# EAGLE design HelvePicV1_1SMDbb (EAGLE 7.3.0)
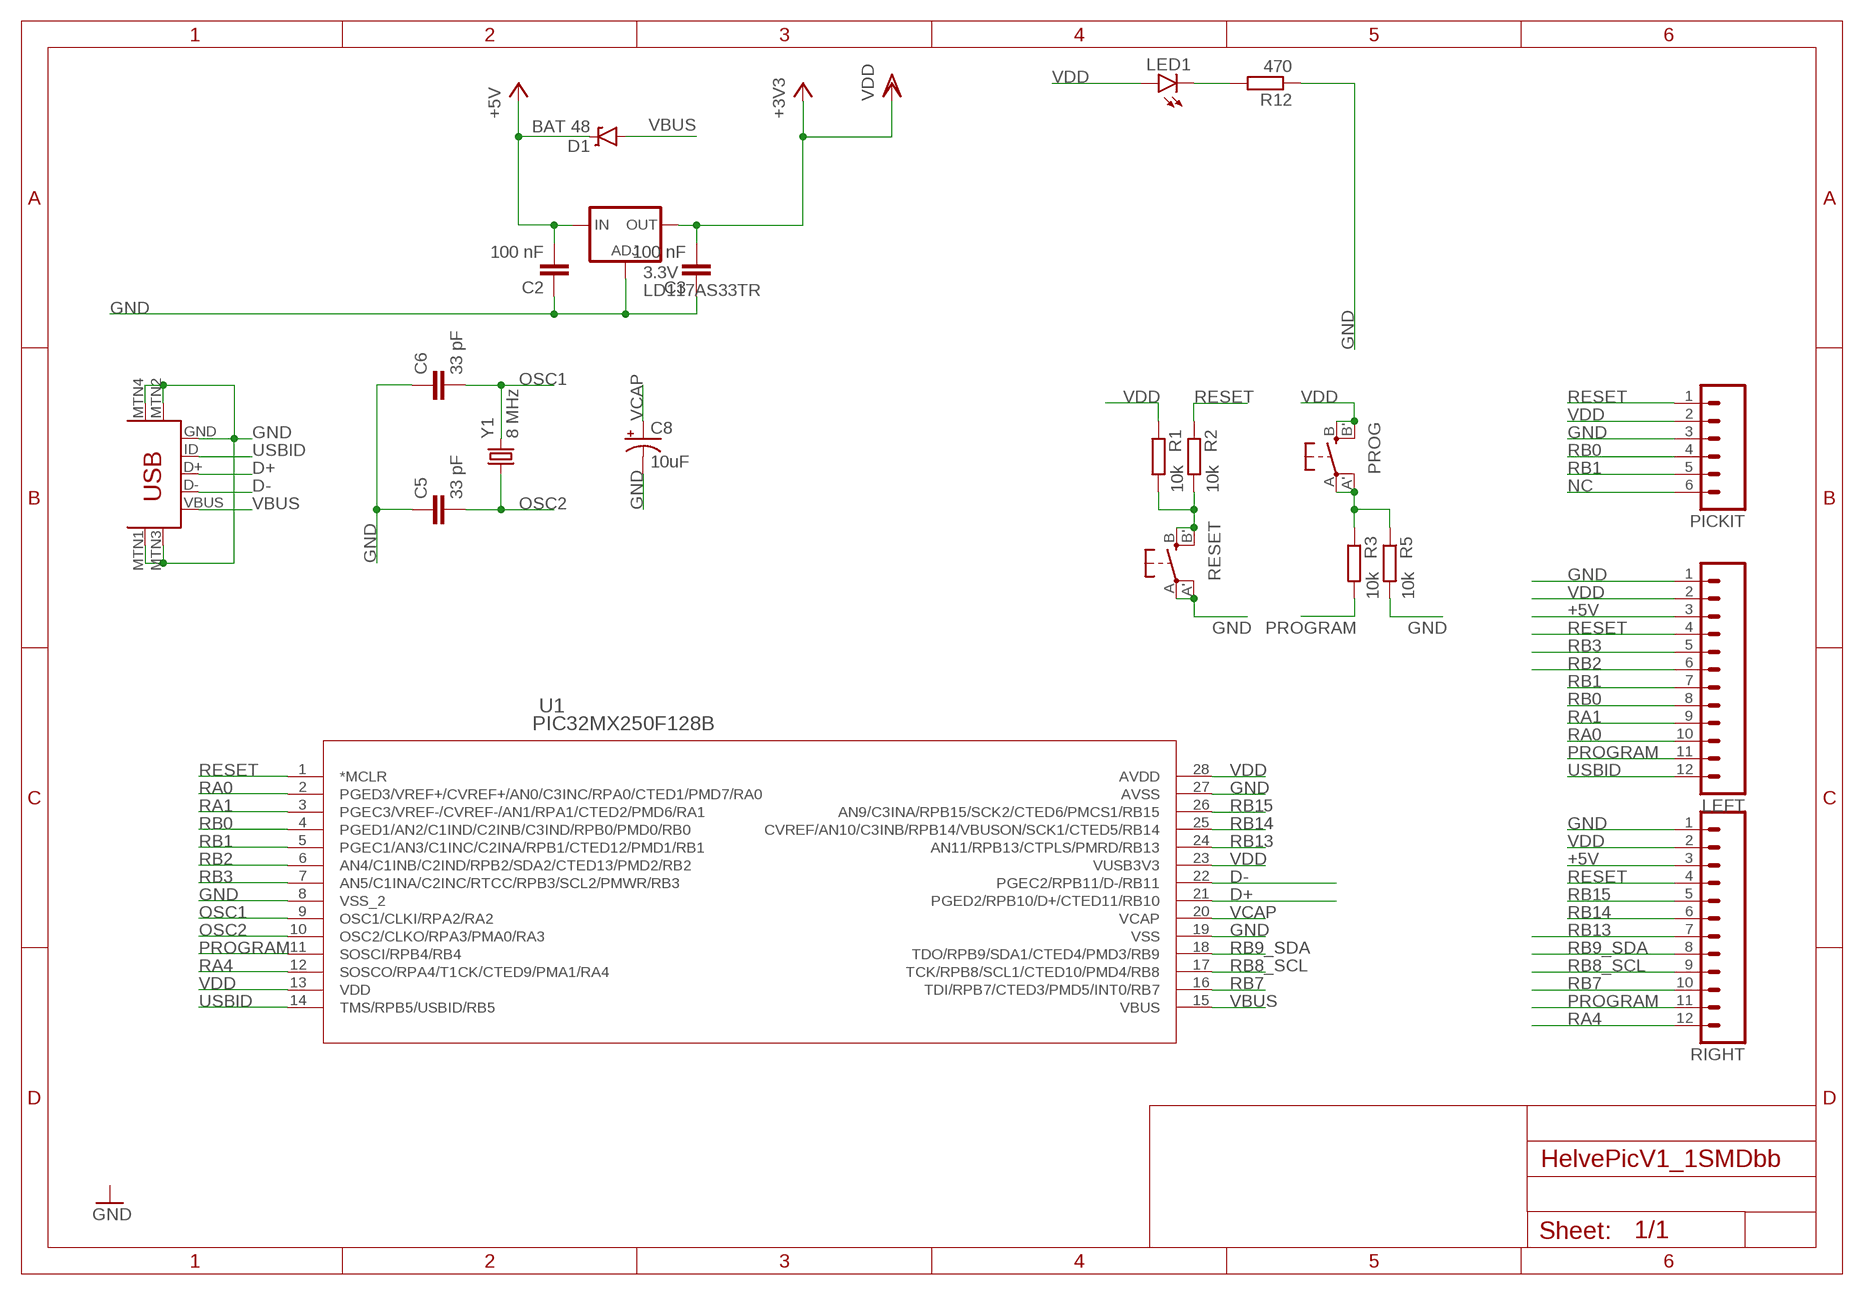
[diagram p0: schematic, sheet 1]

## Parts
3.3V  LD117AS33TR  [SOT223]
C2  100 nF  CAP0805  [0805]
C3  100 nF  CAP0805  [0805]
C5  33 pF  CAP0805  [0805]
C6  33 pF  CAP0805  [0805]
C8  10uF  10UF-16V-10%(TANT)  [EIA3216]
D1  BAT 48  DIODE-ZENERSMB  [SMB-DIODE]
LED1  LED1206  [LED-1206]
LEFT  M12PTH  [1X12]
PICKIT  M06LOCK  [1X06_LOCK]
PROG  SPST_TACT-EVQQ2  [EVQ-Q2]
R1  10k  R-EU_M0805  [M0805]
R2  10k  R-EU_M0805  [M0805]
R3  10k  R-EU_M0805  [M0805]
R5  10k  R-EU_M0805  [M0805]
R12  470  R-EU_M0805  [M0805]
RESET  SPST_TACT-EVQQ2  [EVQ-Q2]
RIGHT  M12PTH  [1X12]
U1  PIC32MX250F128B  PIC32MX250F128B-I_SO  [SOIC28-W_MC]
U$2  USB-MINIB-5PIN  [USB-MINIB]
Y1  8 MHz  CRYSTALSMD  [HC49UP]

## Nets
+5V: 3.3V.3(IN) C2.2 D1.C LEFT.3 RIGHT.3
D+: U1.21(PGED2/RPB10/D+/CTED11/RB10) U$2.D+
D-: U1.22(PGEC2/RPB11/D-/RB11) U$2.D-
GND: 3.3V.1(ADJ) C2.1 C3.1 C5.1 C6.1 C8.C(-) LEFT.1 PICKIT.3 R5.2 R12.1 RESET.A'(P1) RESET.A(P) RIGHT.1 U1.8(VSS_2) U1.19(VSS) U1.27(AVSS) U$2.GND U$2.MTN1(MTN2) U$2.MTN2(MTN3) U$2.MTN3(MTN1) U$2.MTN4
N$2: LED1.C R12.2
N$9: PROG.A'(P1) PROG.A(P) R3.1 R5.1
N$10: R1.2 R2.2 RESET.B'(S1) RESET.B(S)
NC: PICKIT.6
OSC1: C6.2 U1.9(OSC1/CLKI/RPA2/RA2) Y1.2
OSC2: C5.2 U1.10(OSC2/CLKO/RPA3/PMA0/RA3) Y1.1
PROGRAM: LEFT.11 R3.2 RIGHT.11 U1.11(SOSCI/RPB4/RB4)
RA0: LEFT.10 U1.2(PGED3/VREF+/CVREF+/AN0/C3INC/RPA0/CTED1/PMD7/RA0)
RA1: LEFT.9 U1.3(PGEC3/VREF-/CVREF-/AN1/RPA1/CTED2/PMD6/RA1)
RA4: RIGHT.12 U1.12(SOSCO/RPA4/T1CK/CTED9/PMA1/RA4)
RB0: LEFT.8 PICKIT.4 U1.4(PGED1/AN2/C1IND/C2INB/C3IND/RPB0/PMD0/RB0)
RB1: LEFT.7 PICKIT.5 U1.5(PGEC1/AN3/C1INC/C2INA/RPB1/CTED12/PMD1/RB1)
RB2: LEFT.6 U1.6(AN4/C1INB/C2IND/RPB2/SDA2/CTED13/PMD2/RB2)
RB3: LEFT.5 U1.7(AN5/C1INA/C2INC/RTCC/RPB3/SCL2/PMWR/RB3)
RB7: RIGHT.10 U1.16(TDI/RPB7/CTED3/PMD5/INT0/RB7)
RB8_SCL: RIGHT.9 U1.17(TCK/RPB8/SCL1/CTED10/PMD4/RB8)
RB9_SDA: RIGHT.8 U1.18(TDO/RPB9/SDA1/CTED4/PMD3/RB9)
RB13: RIGHT.7 U1.24(AN11/RPB13/CTPLS/PMRD/RB13)
RB14: RIGHT.6 U1.25(CVREF/AN10/C3INB/RPB14/VBUSON/SCK1/CTED5/RB14)
RB15: RIGHT.5 U1.26(AN9/C3INA/RPB15/SCK2/CTED6/PMCS1/RB15)
RESET: LEFT.4 PICKIT.1 R2.1 RIGHT.4 U1.1(*MCLR)
USBID: LEFT.12 U1.14(TMS/RPB5/USBID/RB5) U$2.ID
VBUS: D1.A U1.15(VBUS) U$2.VBUS
VCAP: C8.A(+) U1.20(VCAP)
VDD: 3.3V.4(OUT) C3.2 LED1.A LEFT.2 PICKIT.2 PROG.B'(S1) PROG.B(S) R1.1 RIGHT.2 U1.13(VDD) U1.23(VUSB3V3) U1.28(AVDD) ; supply symbol labelled +3V3

## Library data of the parts
3.3V = v-reg:LD117A?*: Low drop fixed and adjustable positive voltage regulators 1 A Source: http://www.st.com/stonline/products/literature/ds/7194/ld1117axx.pdf
C2 C3 C5 C6 = SparkFun-Capacitors:CAP: Capacitor Standard 0603 ceramic capacitor, and 0.1" leaded capacitor.
C8 = SparkFun-Capacitors:10UF-16V-10%(TANT): CAP-00811 1206/EIA-3216 Tantalum capacitor; PROD_ID: CAP-00811
D1 = SparkFun-DiscreteSemi:DIODE-ZENER: Zener Diode Production Part - 8199 3.4V Zener Voltage
LED1 = SparkFun-LED:LED: LEDs Standard schematic elements and footprints for 5mm, 3mm, 1206, and 0603 sized LEDs. 5mm - Spark Fun Electronics SKU : COM-00529 (and others)
LEFT RIGHT = SparkFun-Connectors:M12: Header 12 Standard 12-pin 0.1" header. Use with straight break away headers (SKU : PRT-00116), right angle break away headers (PRT-00553), swiss pins (PRT-00743), machine pins (PRT-00117), and female headers (PRT-00115).
PICKIT = SparkFun-Connectors:M06: Header 6 Standard 6-pin 0.1" header. Use with straight break away headers (SKU : PRT-00116), right angle break away headers (PRT-00553), swiss pins (PRT-00743), machine pins (PRT-00117), and female headers (PRT-00115). Molex polarized connector foot print use with SKU : PRT-08094 with associated crimp pins and housings. NOTES ON THE VARIANTS LOCK and LOCK_LONGPADS... This footprint was designed to help hold the alignment of a through-hole component (i.e. 6-pin header) while soldering it into place. You may notice that each hole has been shifted either up or down by 0.005 of an inch from it's more standard position (which is a perfectly straight line). This slight alteration caused the pins (the squares in the middle) to touch the edges of the holes. Because they are alternating, it causes a "brace" to hold the component in place. 0.005 has proven to be the perfect amount of "off-center" position when using our standard breakaway headers. Although looks a little odd when you look at the bare footprint, once you have a header in there, the alteration is very hard to notice. Also,if you push a header all the way into place, it is covered up entirely on the bottom side. This idea of altering the position of holes to aid alignment will be further integrated into the Sparkfun Library for other footprints. It can help hold any component with 3 or more connection pins.
PROG RESET = adafruit:SPST_TACT: SMT 6mm switch, EVQQ2 series http://www.ladyada.net/library/eagle
R1-R3 R5 R12 = resistor:R-EU_: RESISTOR, European symbol
U1 = myPIC:PIC32MX250F128B-I_SO
U$2 = SparkFun-Connectors:USB-MINIB: Mini-USB "B" connector with 5th pin broken out. Created new symbol breaking out 5th "ID" pin in mini/micro USB connector spec. See: http://en.wikipedia.org/wiki/Mini_usb#Cables. Uses same footprint as 4-pin symbol. Also added pins to connect to mounting / shield pads if required (probably not generally needed as signals aren't shielded once they leave the connector).
Y1 = SparkFun-FreqCtrl:CRYSTAL: Various standard crystals. Proven footprints. Spark Fun Electronics SKU : COM-00534

## Board
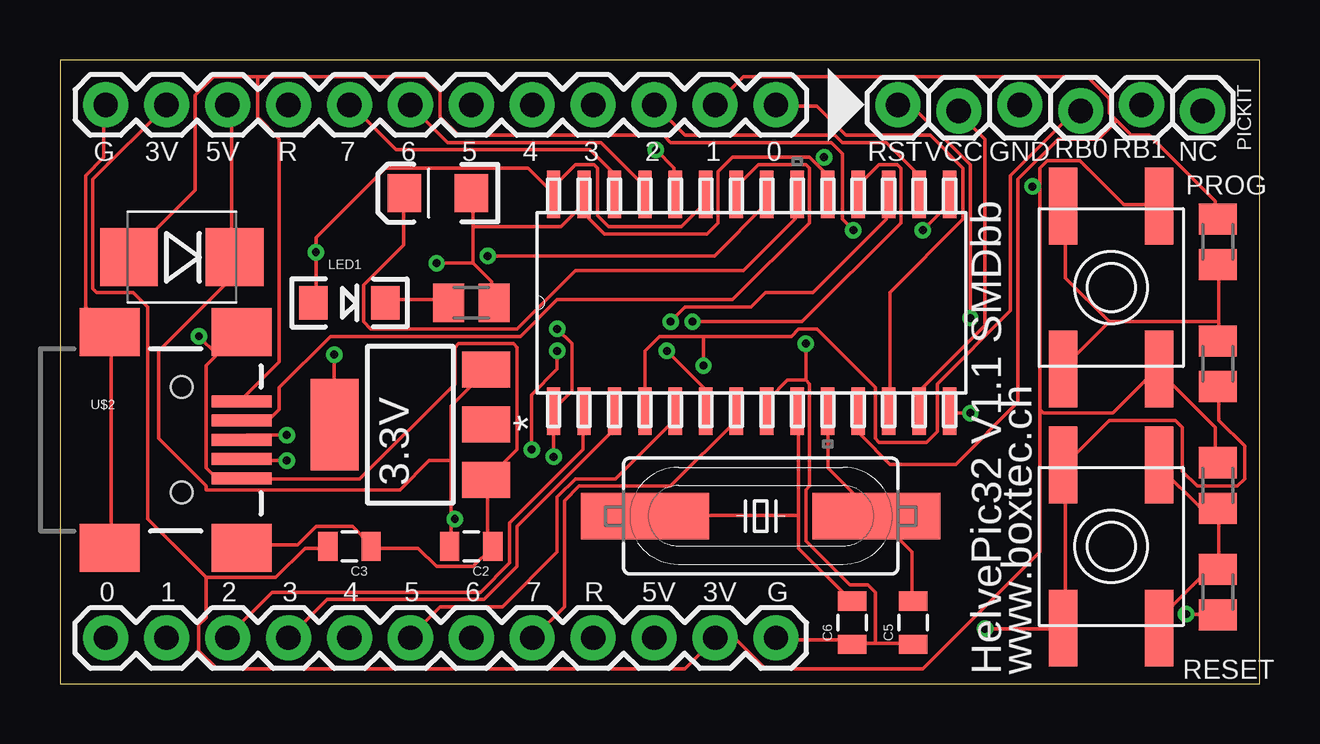
[diagram p1: board, top side]
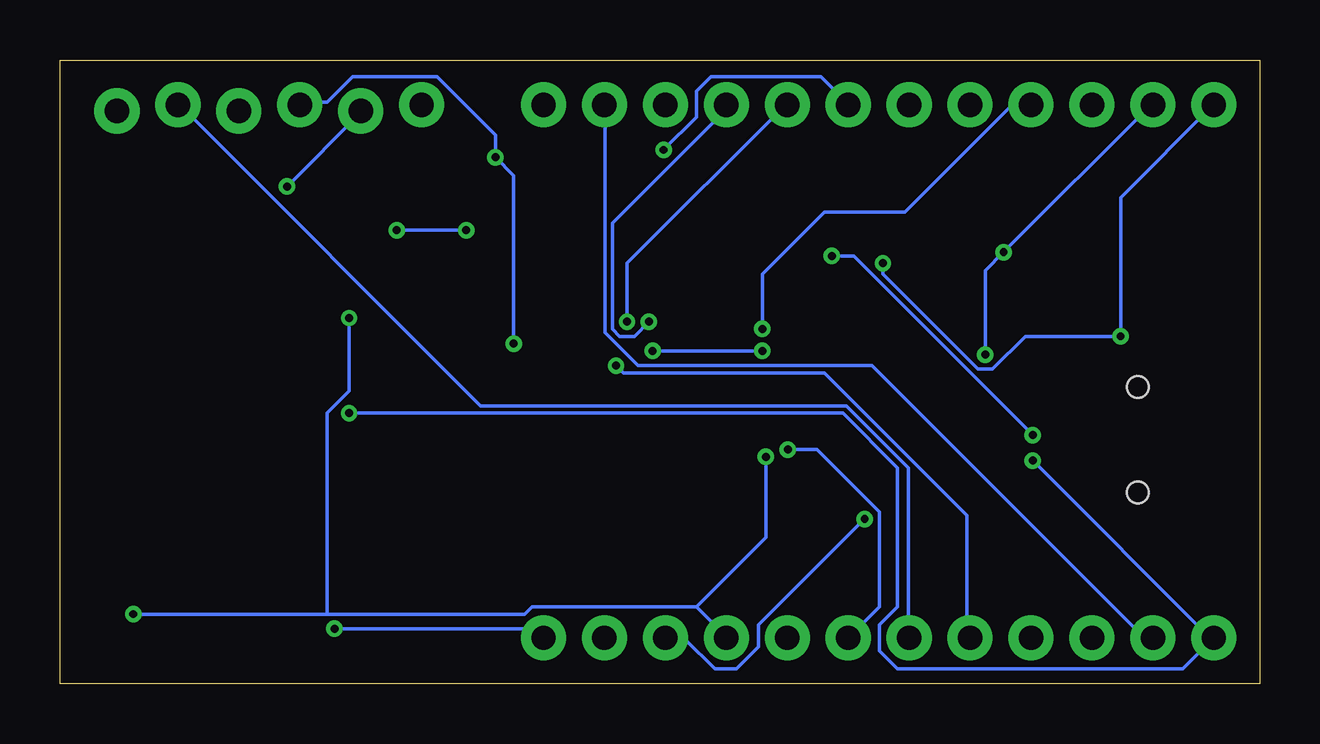
[diagram p2: board, bottom side, seen from below]

Size 50 x 26 mm. Coordinates in mm from the lower left corner, seen from the top.
Outline: 0,0 50,0 50,26 0,26 0,0
Copper layers (1*16): Top 0.0356mm / dielectric 1.5011mm / Bottom 0.0356mm
Design rules "oshpark-2layer": minimum track width 6mil, minimum drill 13mil, track to track 6mil, track to pad 6mil, pad to pad 6mil, via to via 6mil, smd to smd 6mil, copper to edge 15mil, drill to drill 6mil, minimum pad ring 7mil, minimum via ring 7mil, stop-mask expansion 4mil, vias tented up to drill 0mil, thermal gap 10mil

### Footprints (pad centres in the part's own frame; a part is rotated, then mirrored left to right if it is on the bottom)
SOT223 = smd 1.5 x 2: 1 -2.3,-3.15; 2 0,-3.15; 3 2.3,-3.15 | smd 3.8 x 2: 4 0,3.15
0805 = smd 0.8 x 1.2: 1 -0.9,0; 2 0.9,0
EIA3216 = smd 1.4 x 1.6: A 1.4,0; C -1.4,0
SMB-DIODE = smd 2.4 x 2.4: A 2.2,0; C -2.2,0
LED-1206 = smd 1.2 x 1.4: A -1.5,0; C 1.5,0
1X12 = drill 1.016 pad 1.88: 1 0,0; 2 2.54,0; 3 5.08,0; 4 7.62,0; 5 10.16,0; 6 12.7,0; 7 15.24,0; 8 17.78,0; 9 20.32,0; 10 22.86,0; 11 25.4,0; 12 27.94,0
1X06_LOCK = drill 1.016 pad 1.88: 1 0,0; 2 2.54,-0.254; 3 5.08,0; 4 7.62,-0.254; 5 10.16,0; 6 12.7,-0.254
EVQ-Q2 = smd 3.2 x 1.2: A -3.4,-2; A' 3.4,-2; B -3.4,2; B' 3.4,2
M0805 = smd 1.3 x 1.6: 1 -0.95,0; 2 0.95,0
SOIC28-W_MC = smd 1.981 x 0.559: 1 -4.521,8.255; 2 -4.521,6.985; 3 -4.521,5.715; 4 -4.521,4.445; 5 -4.521,3.175; 6 -4.521,1.905; 7 -4.521,0.635; 8 -4.521,-0.635; 9 -4.521,-1.905; 10 -4.521,-3.175; 11 -4.521,-4.445; 12 -4.521,-5.715; 13 -4.521,-6.985; 14 -4.521,-8.255; 15 4.521,-8.255; 16 4.521,-6.985; 17 4.521,-5.715; 18 4.521,-4.445; 19 4.521,-3.175; 20 4.521,-1.905; 21 4.521,-0.635; 22 4.521,0.635; 23 4.521,1.905; 24 4.521,3.175; 25 4.521,4.445; 26 4.521,5.715; 27 4.521,6.985; 28 4.521,8.255
USB-MINIB = smd 2.5 x 0.5: D+ 2.5,0; D- 2.5,0.8; GND 2.5,-1.6; ID 2.5,-0.8; VBUS 2.5,1.6 | smd 2.5 x 2: MTN1 -3,4.5; MTN2 2.5,4.5; MTN3 -3,-4.5; MTN4 2.5,-4.5 | hole 0.9: 0,2.2; 0,-2.2
HC49UP = smd 5.334 x 1.93: 1 -4.826,0; 2 4.826,0

### Placement (x,y rotation side)
3.3V  14.61,10.79 90 top
C2  17.14,5.71 180 top
C3  12.06,5.71 180 top
C5  35.56,2.54 90 top
C6  33.02,2.54 90 top
C8  15.75,20.45 180 top
D1  5.08,17.78 180 top
LED1  12.06,15.88 0 top
LEFT  29.84,1.91 180 top
PICKIT  34.92,24.13 0 top
PROG  43.81,16.51 270 top
R1  48.26,8.26 270 top
R2  48.26,3.81 90 top
R3  48.26,18.41 90 top
R5  48.26,13.34 270 top
R12  17.14,15.88 180 top
RESET  43.81,5.71 270 top
RIGHT  1.91,24.13 0 top
U1  28.83,15.88 90 top
U$2  5.08,10.16 0 top
Y1  29.21,6.99 180 top

### Tracks (layer width: path | path; a pad name or v marks a point on that pad's centre or on a via)
+5V  (via drill 0.33)
  Top 0.152: RIGHT.3 7.01,24.08 7.16,23.93 7.16,17.83 D1.C 7.16,17.68 7.16,16.92 4.12,13.87 4.12,10.21 6.1,8.23 6.1,8.08 14.17,8.08 15.39,9.3 16.31,9.3 | 16.31,9.3 16.31,11.58 17.68,12.95 3.3V.3 | 16.31,9.3 16.31,6.86 | 16.31,6.86 16.31,5.79 C2.2 | 16.31,6.86 v16.46,6.86
  Bottom 0.152: v16.46,6.86 20.88,2.44 20.88,1.52 21.79,0.61 22.71,0.61 23.93,1.83 24.69,1.83 LEFT.3
D+  (via drill 0.33)
  Top 0.152: v17.83,17.83 27.28,17.83 29.41,19.96 29.41,20.27 U1.21 | v9.45,10.36 7.77,10.36 7.62,10.21 U$2.D+
  Bottom 0.152: v17.83,17.83 16.92,17.83 v9.45,10.36
D-
  Top 0.152: U1.22 28.19,20.73 29.11,21.64 31.09,21.64 31.24,21.49 31.24,19.2 28.04,16 20.73,16 19.2,14.48 11.28,14.48 9.14,12.34 9.14,11.43 8.69,10.97 7.62,10.97 U$2.D-
GND  (via drill 0.33)
  Top 0.152: 6.55,13.72 7.47,14.63 U$2.MTN2 6.55,13.72 | 6.55,13.72 6.1,13.26 6.1,8.99 6.4,8.69 7.47,8.69 U$2.GND 7.62,8.53 12.5,8.53 16.46,12.5 16.46,14.02 16.61,14.17 18.9,14.17 19.05,14.02 19.05,9.75 17.83,8.53 3.3V.1 17.83,8.38 17.83,5.94 17.98,5.79 C2.1 17.98,5.64 17.22,4.88 15.7,4.88 14.94,5.64 13.11,5.64 C3.1 12.95,5.79 12.19,6.55 10.67,6.55 9.91,5.79 7.62,5.79 U$2.MTN4 | U$2.MTN3 2.13,5.79 2.13,14.63 U$2.MTN1 1.98,14.78 1.07,15.7 1.07,21.18 1.83,21.95 1.83,24.08 RIGHT.1 | v5.79,14.48 6.55,13.72 | R5.2 48.31,12.34 48.31,10.97 49.38,9.91 49.38,8.53 49.07,8.23 47.4,8.23 46.79,8.84 46.79,10.67 46.48,10.97 43.74,10.97 41.91,9.14 RESET.A 41.91,8.99 41.91,2.44 RESET.A' 41.76,2.29 v38.56,2.29 | 33.98,1.68 35.51,1.68 C5.1 | 33.98,1.68 33.07,1.68 C6.1 32.92,1.68 32.77,1.83 29.87,1.83 LEFT.1 | 31.09,12.65 30.33,12.65 29.57,11.89 29.57,11.43 U1.8 | 31.09,12.65 31.24,12.5 31.24,8.23 31.09,8.08 31.09,5.94 32.92,4.12 33.68,4.12 33.98,3.81 33.98,1.68 | 17.22,17.53 17.98,16.76 17.98,16 R12.1 | 17.22,19.05 17.22,20.42 C8.C | 17.22,19.05 17.22,17.53 | 21.64,19.81 20.88,19.05 17.22,19.05 | 21.64,19.81 21.79,19.96 21.79,20.27 U1.27 21.64,19.81 | U1.19 32,21.18 31.55,21.64 | 31.55,21.64 31.24,21.95 28.04,21.95 27.43,21.34 27.43,19.2 26.98,18.75 22.71,18.75 21.64,19.81 | 31.55,21.64 v31.85,21.95 | v31.09,14.17 31.09,12.65 | 17.22,17.53 v15.7,17.53
  Bottom 0.152: RIGHT.1 1.98,24.08 5.79,20.27 v5.79,14.48 9.75,14.48 11.12,13.11 11.73,13.11 15.7,17.07 v15.7,17.53 | PICKIT.3 39.93,24.23 38.86,24.23 37.8,25.3 34.29,25.3 31.85,22.86 v31.85,21.95 31.09,21.18 v31.09,14.17 | v38.56,2.29 30.18,2.29 29.87,1.98 LEFT.1
N$2
  Top 0.152: LED1.C 13.72,16 16.15,16 R12.2
N$9
  Top 0.152: 48.31,15.09 48.31,17.37 R3.1 | 48.31,15.09 48.31,14.33 R5.1 | 43.74,15.09 48.31,15.09 | 43.74,15.09 41.91,13.26 PROG.A' | 43.74,15.09 41.91,16.92 41.91,19.81 PROG.A
N$10
  Top 0.152: RESET.B 45.87,8.99 47.55,7.32 48.16,7.32 R1.2 48.31,7.16 48.31,4.88 R2.2 48.16,4.72 47.85,4.72 45.87,2.74 45.87,2.44 RESET.B'
OSC1
  Top 0.152: 30.79,7.01 30.79,11.28 U1.9 | 30.79,7.01 30.79,5.64 32.92,3.5 C6.2 | 30.79,7.01 24.38,7.01 Y1.2
OSC2
  Top 0.152: C5.2 35.51,3.5 35.51,5.49 34.14,6.86 Y1.1 33.98,7.01 32,8.99 U1.10
PROGRAM
  Top 0.152: 44.04,23.47 43.74,23.77 43.74,24.38 42.82,25.3 28.5,25.3 27.43,24.23 RIGHT.11 | 44.04,23.47 44.65,22.86 45.41,22.86 48.16,20.12 48.16,19.51 R3.2 | 44.04,23.47 43.28,22.71 41.6,22.71 39.93,21.03 39.93,11.73 37.34,9.14 34.59,9.14 33.38,10.36 33.38,11.28 U1.11
  Bottom 0.152: LEFT.11 4.57,1.98 4.88,1.98 16.15,13.26 25.91,13.26 27.28,14.63 27.28,24.08 RIGHT.11
RA0
  Top 0.152: U1.2 21.79,11.28 21.79,9.75 18.75,6.71 18.75,5.03 17.53,3.81 8.84,3.81 7.01,1.98 LEFT.10
RA1
  Top 0.152: LEFT.9 11.12,3.5 17.68,3.5 19.05,4.88 19.05,6.55 23.01,10.52 23.01,11.28 U1.3
RA4
  Top 0.152: U1.12 34.59,11.43 34.59,16.31 37.64,19.36 37.64,21.49 36.27,22.86 32.77,22.86 31.55,24.08 29.87,24.08 RIGHT.12
RB0  (via drill 0.33)
  Top 0.152: U1.4 24.38,13.87 24.99,14.48 26.82,14.48 | 26.82,14.48 30.48,14.48 30.79,14.78 31.55,14.78 33.98,12.34 33.98,10.21 34.14,10.06 36.12,10.06 36.58,10.52 36.58,12.5 39.62,15.54 39.62,21.18 42.22,23.77 42.52,23.77 PICKIT.4 | 26.82,14.48 v26.82,13.26
  Bottom 0.152: v26.82,13.26 26.52,12.95 18.14,12.95 12.19,7.01 12.19,1.98 LEFT.8
RB1
  Top 0.152: U1.5 25.6,11.28 25.6,10.97 23.16,8.53 21.49,8.53 20.73,7.77 20.73,5.49 18.44,3.2 15.85,3.2 14.63,1.98 LEFT.7
  Bottom 0.152: PICKIT.5 44.96,24.08 32.46,11.58 17.22,11.58 14.63,8.99 14.63,1.98 LEFT.7
RB2  (via drill 0.33)
  Top 0.152: v25.3,13.87 26.82,12.34 26.82,11.43 U1.6 | v20.73,13.87 20.73,13.11 19.66,12.04 v19.66,9.75
  Bottom 0.152: v20.73,13.87 v25.3,13.87 | v19.66,9.75 18.44,9.75 15.85,7.16 15.85,3.2 LEFT.6
RB3
  Top 0.152: U1.7 28.19,10.97 25.45,8.23 21.64,8.23 21.03,7.62 21.03,3.2 19.81,1.98 LEFT.5
RB7
  Top 0.152: U1.16 35.81,21.18 34.44,22.55 32.61,22.55 32.31,22.86 26.06,22.86 24.84,24.08 RIGHT.10
RB8_SCL  (via drill 0.33)
  Top 0.152: v25.45,15.09 26.06,15.7 28.8,15.7 29.41,16.31 31.39,16.31 34.44,19.36 34.44,20.27 U1.17
  Bottom 0.152: v25.45,15.09 26.06,14.48 26.67,14.48 26.98,14.78 26.98,19.2 22.1,24.08 RIGHT.9
RB9_SDA  (via drill 0.33)
  Top 0.152: v26.36,15.09 30.94,15.09 35.05,19.2 35.05,21.49 34.9,21.64 34.14,21.64 33.38,20.88 33.38,20.42 U1.18
  Bottom 0.152: v26.36,15.09 26.36,17.53 19.81,24.08 RIGHT.8
RB13  (via drill 0.33)
  Top 0.152: v24.84,22.25 25.6,21.49 25.6,20.42 U1.24
  Bottom 0.152: v24.84,22.25 23.47,23.62 23.47,24.69 22.86,25.3 18.29,25.3 17.22,24.23 RIGHT.7
RB14
  Top 0.152: U1.25 24.38,20.73 22.55,22.55 16.15,22.55 14.63,24.08 RIGHT.6
RB15
  Top 0.152: U1.26 23.01,20.42 23.01,21.34 22.1,22.25 14.02,22.25 12.19,24.08 RIGHT.5
RESET  (via drill 0.33)
  Top 0.152: v46.94,2.9 48.16,2.9 R2.1 | v20.57,9.45 U1.1 20.57,11.43 21.34,12.19 21.34,14.17 v20.73,14.78 | v37.95,15.24 37.95,21.64 35.51,24.08 35.05,24.08 PICKIT.1
  Bottom 0.152: 38.86,2.9 30.63,2.9 30.33,3.2 23.47,3.2 | 38.86,2.9 v46.94,2.9 | 23.47,3.2 22.25,1.98 LEFT.4 | v20.57,9.45 20.57,6.1 23.47,3.2 | v20.73,14.78 20.73,17.07 18.14,19.66 14.78,19.66 10.36,24.08 9.6,24.08 RIGHT.4 | v37.95,15.24 37.95,12.19 38.86,11.28 38.86,2.9
USBID  (via drill 0.33)
  Top 0.152: v37.95,11.28 37.19,11.28 U1.14 | v9.45,9.3 7.62,9.3 U$2.ID
  Bottom 0.152: v37.95,11.28 17.37,11.28 15.09,8.99 15.09,3.2 15.85,2.44 15.85,1.37 15.09,0.61 3.2,0.61 1.98,1.83 | 1.98,1.83 v9.45,9.3 | 1.98,1.83 LEFT.12
VBUS  (via drill 0.33)
  Top 0.152: v35.97,18.9 37.03,19.96 37.03,20.27 U1.15 | v33.07,18.9 32.61,19.36 32.61,22.1 32.16,22.55 25.45,22.55 25.15,22.86 16.61,22.86 15.85,23.62 15.85,24.69 15.24,25.3 8.23,25.3 | 8.23,25.3 6.4,25.3 5.64,24.54 5.64,20.57 2.9,17.83 D1.A | 8.23,25.3 8.23,23.62 9.14,22.71 9.14,13.41 7.62,11.89 U$2.VBUS
  Bottom 0.152: v33.07,18.9 v35.97,18.9
VCAP
  Top 0.152: C8.A 14.33,20.42 14.33,18.29 12.65,16.61 12.65,15.09 12.95,14.78 19.05,14.78 21.49,17.22 28.5,17.22 30.63,19.36 30.63,20.27 U1.20
VDD  (via drill 0.33)
  Top 0.152: 20.42,20.57 20.57,20.42 U1.28 20.42,20.57 | 20.42,20.57 19.51,21.49 13.56,21.49 10.67,18.59 v10.67,17.98 10.67,16 LED1.A | 20.42,20.57 21.49,21.64 22.25,21.64 22.4,21.49 22.4,19.51 22.86,19.05 25.91,19.05 26.82,19.96 26.82,20.27 U1.23 | 6.1,4.42 8.99,4.42 10.21,5.64 11.12,5.64 C3.2 | 6.1,4.42 3.66,6.86 3.66,15.7 3.05,16.31 1.52,16.31 1.37,16.46 1.37,21.03 4.42,24.08 RIGHT.2 | v11.43,13.72 11.43,10.82 3.3V.4 | U1.13 35.81,12.19 38.56,14.94 38.56,22.71 37.49,23.77 PICKIT.2 | 45.72,13.11 48.16,10.67 48.16,9.3 R1.1 | 40.84,11.43 40.84,20.73 | 40.84,20.73 40.84,21.49 41.15,21.79 42.52,21.79 44.35,19.96 45.72,19.96 PROG.B | 40.84,11.43 41,11.28 43.89,11.28 45.72,13.11 | 45.72,13.11 PROG.B' | 40.84,11.43 40.84,5.49 35.97,0.61 29.41,0.61 28.19,1.83 27.43,1.83 LEFT.2 27.28,1.83 26.06,0.61 6.55,0.61 5.79,1.37 5.79,2.44 6.1,2.74 6.1,4.42 | 40.84,20.73 v40.54,20.73
  Bottom 0.152: v11.43,13.72 11.43,17.22 v10.67,17.98 4.57,24.08 RIGHT.2 | v40.54,20.73 37.49,23.77 PICKIT.2

### Text on the board
tNames: G | 3V | 5V | R | 7 | 6 | 5 | 4 | 3 | 2 | 1 | 0 | RST | VCC | GND | RB0 | RB1 | NC | 0 | 1 | 2 | 3 | 4 | 5 | 6 | 7 | R | 5V | 3V | G | HelvePic32 V1.1 SMDbb | www.boxtec.ch